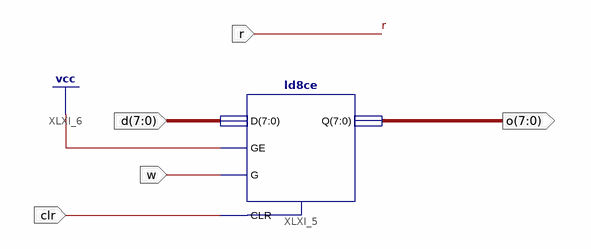
[diagram p0: schematic sheet 1]
// Xilinx ISE schematic reg_8bit.sch (aspartan6) as structural Verilog: 1 symbols, 5 ports
module reg_8bit (
  input  [7:0] d,
  input  w,
  input  clr,
  input  r,
  output [7:0] o
);

  ld8ce XLXI_5 (.CLR(clr), .D(d), .G(w), .GE(1'b1), .Q(o));
endmodule
